# Altium project Samba2_Lantern.PrjPcb
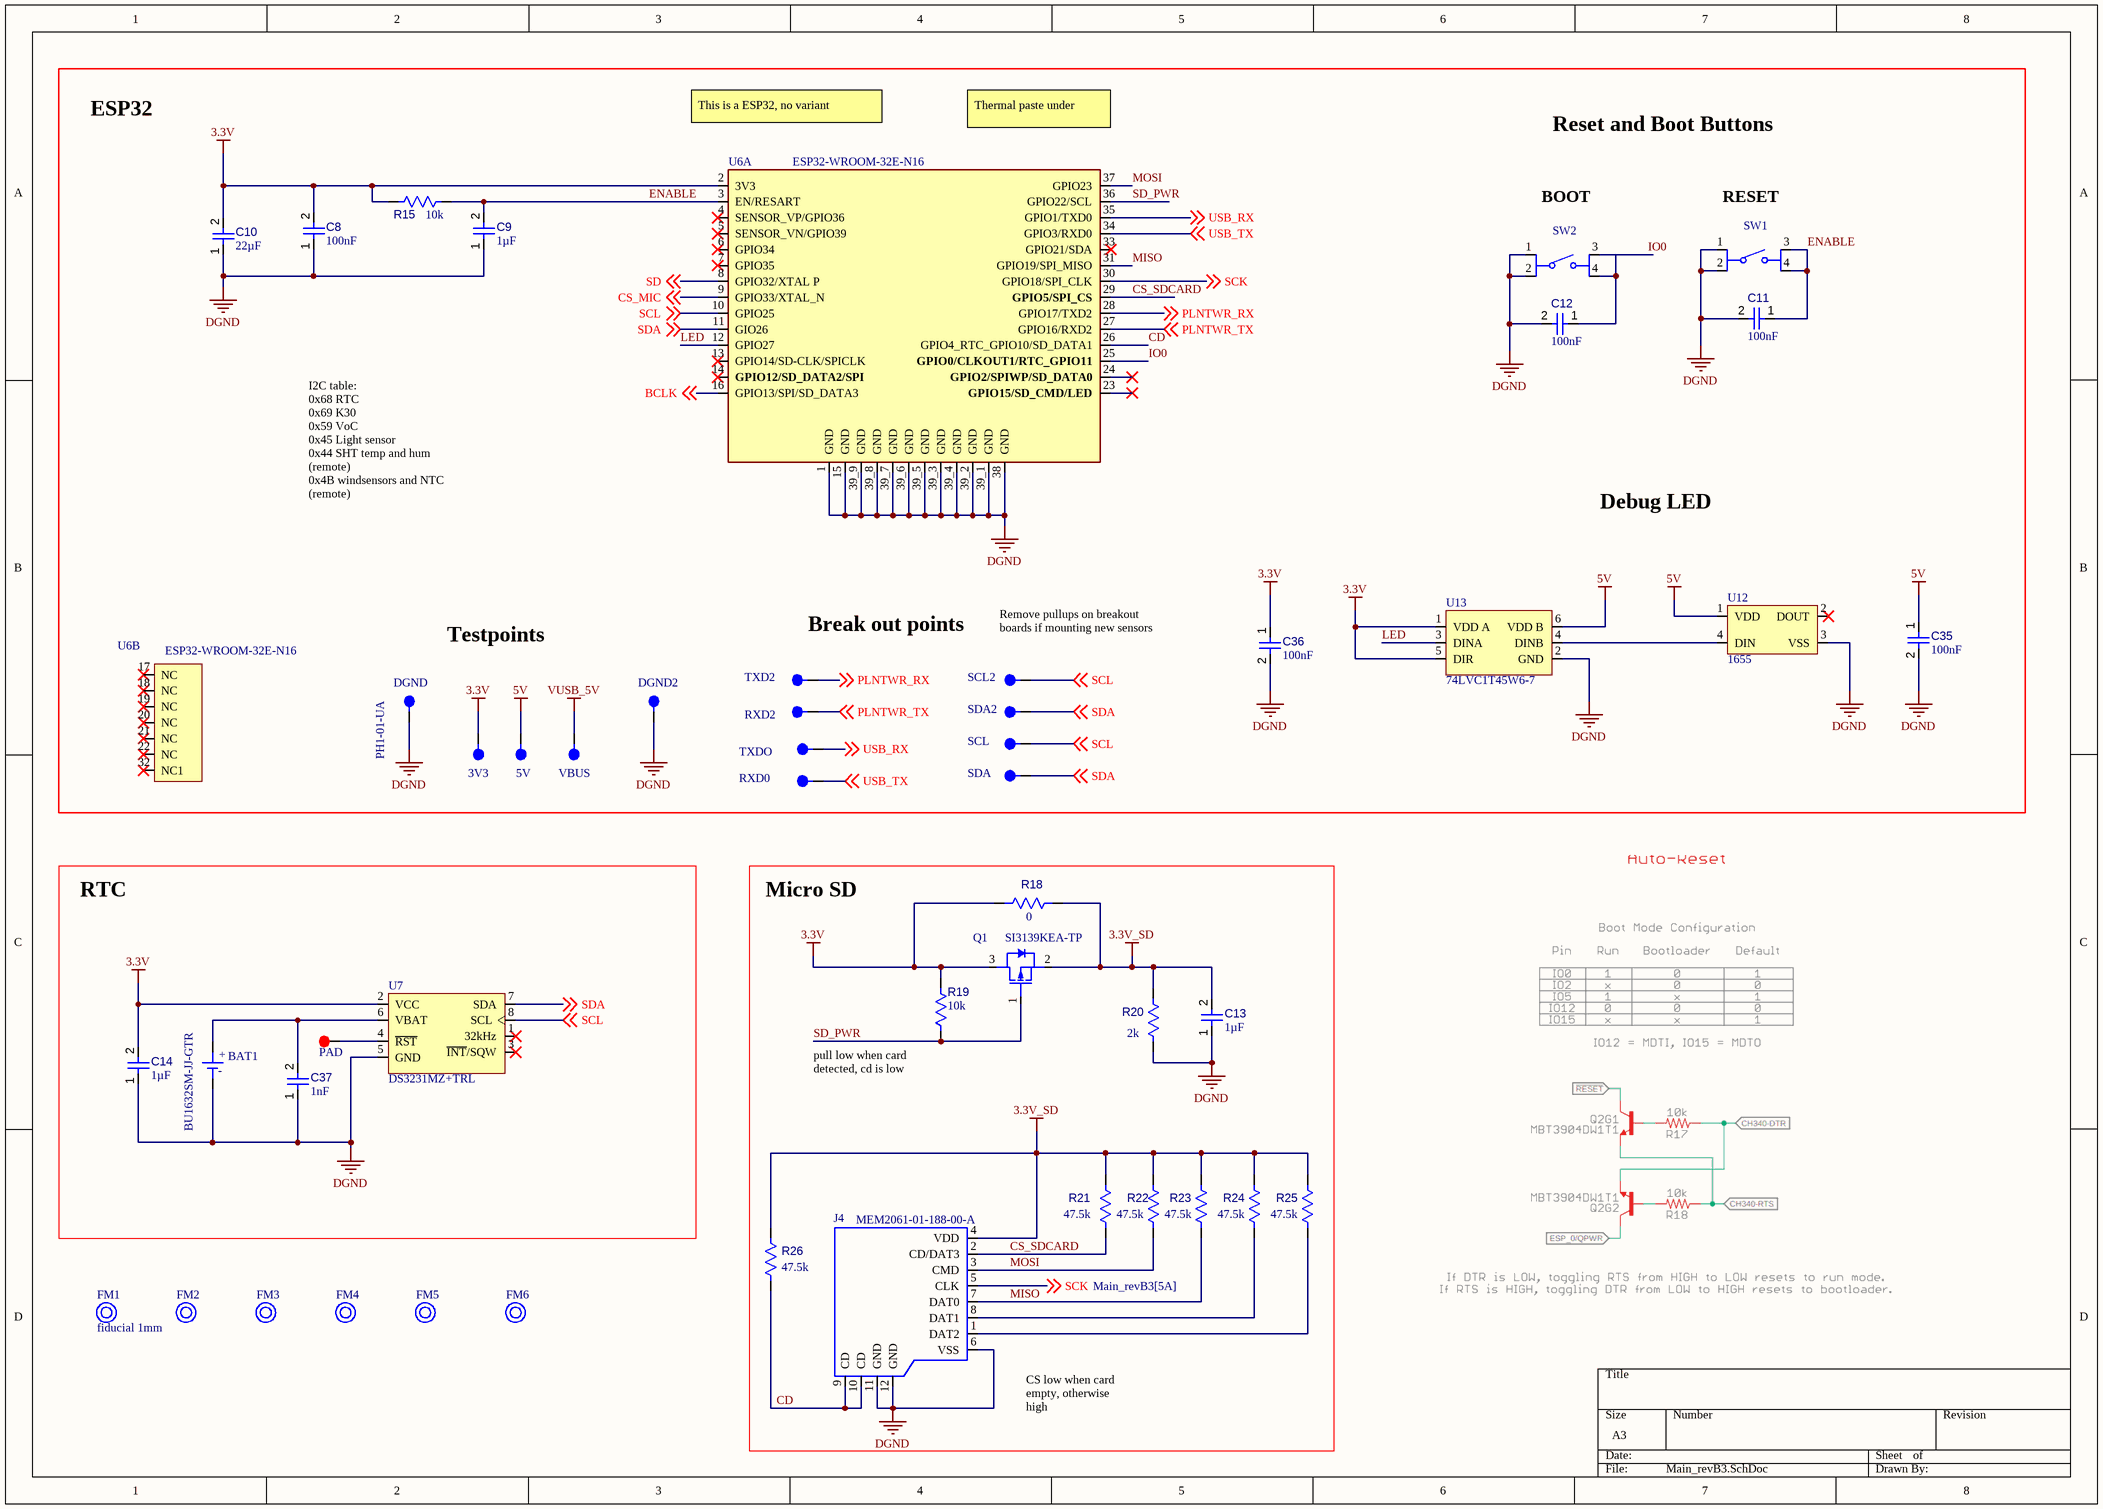
[diagram p0: Main_revB3.SchDoc]
3 sheets, 136 parts. Net scope: global (net labels, ports and power ports of the same name join across sheets).
Board file: Lantern_REV_B3.PcbDoc
Sheets:
  Main_revB3.SchDoc
  Sensors_revB3.SchDoc
  Power_revB3.SchDoc

## Sheet Main_revB3.SchDoc
size A3; SheetNumber: 1; SheetTotal: 4

### Parts
3V3  PH1-01-UA  [FP-PH1-01-UA-MFG]  (value not drawn)  (no BOM)
5V  PH1-01-UA  [FP-PH1-01-UA-MFG]  (value not drawn)  (no BOM)
BAT1  BU1632SM-JJ-GTR  [BU1632SM-JJ-GTR-Footprint-1]
C8  value 100nF  [MANUF_CAP_0603]  (hidden comment: CC0603KRX7R7BB104)
C9  value 1µF  [MANUF_CAP_0603]  (hidden comment: CL10B105KA8NFNC)
C10  value 22µF  [FP-GRM21B-0_2-e0_2_0_7-MFG]  (hidden comment: GRM21BZ71A226ME15L)
C11  value 100nF  [MANUF_CAP_0603]  (hidden comment: CC0603KRX7R7BB104)
C12  value 100nF  [MANUF_CAP_0603]  (hidden comment: CC0603KRX7R7BB104)
C13  value 1µF  [MANUF_CAP_0603]  (hidden comment: CL10B105KA8NFNC)
C14  value 1µF  [MANUF_CAP_0603]  (hidden comment: CL10B105KA8NFNC)
C35  value 100nF  [MANUF_CAP_0603]  (hidden comment: CC0603KRX7R7BB104)
C36  value 100nF  [MANUF_CAP_0603]  (hidden comment: CC0603KRX7R7BB104)
C37  value 1nF  [0805]  (hidden comment: C0805C102K2GEC7800)
DGND  PH1-01-UA  [FP-PH1-01-UA-MFG]  (no BOM)
DGND2  PH1-01-UA  [FP-PH1-01-UA-MFG]  (value not drawn)  (no BOM)
FM1  fiducial 1mm  [fiducial 1mm-Footprint-1]  (no BOM)
FM2  fiducial 1mm  [fiducial 1mm-Footprint-1]  (value not drawn)  (no BOM)
FM3  fiducial 1mm  [fiducial 1mm-Footprint-1]  (value not drawn)  (no BOM)
FM4  fiducial 1mm  [fiducial 1mm-Footprint-1]  (value not drawn)  (no BOM)
FM5  fiducial 1mm  [fiducial 1mm-Footprint-1]  (value not drawn)  (no BOM)
FM6  fiducial 1mm  [fiducial 1mm-Footprint-1]  (value not drawn)  (no BOM)
J4  MEM2061-01-188-00-A  [MEM2061-01-188-00-A-Footprint-1]
P1  PAD  [PAD-Footprint-1]  (no BOM)
Q1  SI3139KEA-TP  [SOT50P160X80-3N]
R15  value 10k  [MANUF_RES_0603]  (hidden comment: RC0603FR-0710KL)
R18  value 0  [MANUF_RES_0603]  (hidden comment: Resistor 0R +/- 5% 0603 100 mW)
R19  value 10k  [MANUF_RES_0603]  (hidden comment: RC0603FR-0710KL)
R20  value 2k  [MANUF_RES_0603]  (hidden comment: ERJ-3EKF2001V)
R21  value 47.5k  [MANUF_RES_0603]  (hidden comment: CRCW060347K5FKEAHP)
R22  value 47.5k  [MANUF_RES_0603]  (hidden comment: CRCW060347K5FKEAHP)
R23  value 47.5k  [MANUF_RES_0603]  (hidden comment: CRCW060347K5FKEAHP)
R24  value 47.5k  [MANUF_RES_0603]  (hidden comment: CRCW060347K5FKEAHP)
R25  value 47.5k  [MANUF_RES_0603]  (hidden comment: CRCW060347K5FKEAHP)
R26  value 47.5k  [MANUF_RES_0603]  (hidden comment: CRCW060347K5FKEAHP)
RXD0  PH1-01-UA  [FP-PH1-01-UA-MFG]  (value not drawn)  (no BOM)
RXD2  PH1-01-UA  [FP-PH1-01-UA-MFG]  (value not drawn)  (no BOM)
SCL  PH1-01-UA  [FP-PH1-01-UA-MFG]  (value not drawn)  (no BOM)
SCL2  PH1-01-UA  [FP-PH1-01-UA-MFG]  (value not drawn)  (no BOM)
SDA  PH1-01-UA  [FP-PH1-01-UA-MFG]  (value not drawn)  (no BOM)
SDA2  PH1-01-UA  [FP-PH1-01-UA-MFG]  (value not drawn)  (no BOM)
SW1  PTS526SK15SMTR2LFS  [FP-PTS526SK15SMTR2LFS-MFG]  (value not drawn)
SW2  PTS526SK15SMTR2LFS  [FP-PTS526SK15SMTR2LFS-MFG]  (value not drawn)
TXD2  PH1-01-UA  [FP-PH1-01-UA-MFG]  (value not drawn)  (no BOM)
TXDO  PH1-01-UA  [FP-PH1-01-UA-MFG]  (value not drawn)  (no BOM)
U6  ESP32-WROOM-32E-N16  [ESP32-WROOM-32E-N16-Footprint-1]  (parts A,B of 2)
U7  DS3231MZ+TRL  [S8MK+1_M]
U12  1655  [ADA-RGB-1655_V]
U13  74LVC1T45W6-7  [SOT95P285X130-6N]
VBUS  PH1-01-UA  [FP-PH1-01-UA-MFG]  (value not drawn)  (no BOM)

### Blocks framed on the sheet
RTC: BAT1 C14 C37 P1 U7
Micro SD: C13 J4 Q1 R18-R26

### Nets
3.3V: 3V3.1 C8.2 C10.2 C14.2 C36.1 Q1.3(D) R15.2 R18.2 R19.1 U6.2(3V3) U7.2(VCC) U13.1(VDD_A) U13.5(DIR)
3.3V_SD: C13.2 J4.4(VDD) Q1.2(S) R18.1 R20.1 R21.2 R22.2 R23.2 R24.2 R25.2 R26.2
5V: 5V.1 C35.1 U12.1(VDD) U13.6(VDD_B)
DGND: BAT1.2(-) C8.1 C9.1 C10.1 C11.2 C12.2 C13.1 C14.1 C35.2 C36.2 C37.1 DGND.1 DGND2.1 J4.6(VSS) J4.11(GND) J4.12(GND) R20.2 SW1.1 SW1.2 SW2.1 SW2.2 U6.1(GND) U6.15(GND) U6.38(GND) U6.39_1(GND) U6.39_2(GND) U6.39_3(GND) U6.39_4(GND) U6.39_5(GND) U6.39_6(GND) U6.39_7(GND) U6.39_8(GND) U6.39_9(GND) U7.5(GND) U12.3(VSS) U13.2(GND)
VUSB_5V: VBUS.1
BCLK: U6.16(GPIO13/SPI/SD_DATA3) ; off-sheet BCLK
CD: J4.9(CD) J4.10(CD) R26.1 U6.26(GPIO4_RTC_GPIO10/SD_DATA1)
CS_MIC: U6.9(GPIO33/XTAL_N) ; off-sheet CS_MIC
CS_SDCARD: J4.2(CD/DAT3) R21.1 U6.29(GPIO5/SPI_CS)
ENABLE: C9.2 C11.1 R15.1 SW1.3 SW1.4 U6.3(EN/RESART)
IO0: C12.1 SW2.3 SW2.4 U6.25(GPIO0/CLKOUT1/RTC_GPIO11)
LED: U6.12(GPIO27) U13.3(DINA)
MISO: J4.7(DAT0) R23.1 U6.31(GPIO19/SPI_MISO)
MOSI: J4.3(CMD) R22.1 U6.37(GPIO23)
PLNTWR_RX: TXD2.1 U6.28(GPIO17/TXD2) ; off-sheet PLNTWR_RX
PLNTWR_TX: RXD2.1 U6.27(GPIO16/RXD2) ; off-sheet PLNTWR_TX
SCK: J4.5(CLK) U6.30(GPIO18/SPI_CLK) ; off-sheet SCK
SCL: SCL.1 SCL2.1 U6.10(GPIO25) U7.8(SCL) ; off-sheet SCL
SD: U6.8(GPIO32/XTAL_P) ; off-sheet SD
SD_PWR: Q1.1(G) R19.2 U6.36(GPIO22/SCL)
SDA: SDA.1 SDA2.1 U6.11(GIO26) U7.7(SDA) ; off-sheet SDA
USB_RX: TXDO.1 U6.35(GPIO1/TXD0) ; off-sheet USB_RX
USB_TX: RXD0.1 U6.34(GPIO3/RXD0) ; off-sheet USB_TX
NetBAT1_1: BAT1.1(+) C37.2 U7.6(VBAT)
NetJ4_1: J4.1(DAT2) R25.1
NetJ4_8: J4.8(DAT1) R24.1
NetP1_1: P1.1 U7.4(~{RST})
NetU12_4: U12.4(DIN) U13.4(DINB)

Not connected (* = marked no-connect by the designer): U6 4(SENSOR_VP/GPIO36)* 5(SENSOR_VN/GPIO39)* 6(GPIO34)* 7(GPIO35)* 13(GPIO14/SD-CLK/SPICLK)* 14(GPIO12/SD_DATA2/SPI)* 17(NC)* 18(NC)* 19(NC)* 20(NC)* 21(NC)* 22(NC)* 23(GPIO15/SD_CMD/LED)* 24(GPIO2/SPIWP/SD_DATA0)* 32(NC1)* 33(GPIO21/SDA)*; U7 1(32kHz)* 3(~{INT}/SQW)*; U12 2(DOUT)*

### Notes on the sheet
- ESP32
- This is a ESP32, no variant
- Thermal paste under
- Reset and Boot Buttons
- (near SW2) BOOT
- (near SW1) RESET
- Debug LED
- I2C table:
  0x68 RTC
  0x69 K30
  0x59 VoC
  0x45 Light sensor
  0x44 SHT temp and hum (remote)
  0x4B windsensors and NTC (remote)
- Testpoints
- Break out points
- (near SCL2) Remove pullups on breakout boards if mounting new sensors
- (near R19) pull low when card detected, cd is low
- CS low when card empty, otherwise high

### Library data of the parts
3V3 5V DGND DGND2 RXD0 RXD2 SCL SCL2 SDA SDA2 TXD2 TXDO VBUS = CMP-002-00083-1: Conn Unshrouded Header HDR 1 POS 2.54mm Solder ST Thru-Hole Bag
BAT1 = CMP-002-00085-2: battery holder cr1632
C8 C11 C12 C35 C36 = CMP-001-00099-4: Ceramic Capacitor, Multilayer, Ceramic, 16V, 10% +Tol, 10% -Tol, X7R, 15% TC, 0.1uF, Surface Mount, 0603; Pins: 2; Min Operating Temperature: -55°C; Max Operating Temperature: 125°C; Case/Package: 0603; RoHS Compliant: Yes; Mounting Technology: Surface Mount; Capacitor Type: Ceramic
C9 C13 C14 = CMP-001-00098-2: Ceramic Capacitor, Multilayer, Ceramic, 25V, 10% +Tol, 10% -Tol, X7R, 15% TC, 1uF, Surface Mount, 0603; Pins: 2; Mounting Technology: Surface Mount; Min Operating Temperature: -55°C; Case/Package: 0603; Capacitor Type: Ceramic; RoHS Compliant: Yes; Max Operating Temperature: 125°C
C10 = CMP-001-00091-2: Ceramic Capacitor, Multilayer, Ceramic, 10V, 20% +Tol, 20% -Tol, X7R, 15% TC, 22uF, Surface Mount, 0805; Capacitor Type: Ceramic; Min Operating Temperature: -55°C; Pins: 2; Max Operating Temperature: 125°C; Case/Package: 0805; Mounting Technology: Surface Mount; RoHS Compliant: Yes
C37 = CMP-001-00100-1: ESD SMD Comm C0G 0805 (2012Metric) Ceramic Capacitor 0.079Lx0.049W 2.00mmx1.25mm C0G NP0 ±10% 1000pF; Tolerance: 10%; Case/Package: 0805
FM1-FM6 = CMP-00030-00004-9: fiducial marker 2D
J4 = CMP-002-00080-1: Micro SD card, push in, push out; Connector Type: PCB; RoHS Compliant: Yes
P1 = CMP-00030-00002-1: a pad to pull out pins
Q1 = CMP-013-00037-1: P-Channel 20 V 600 mA 150 mW Surface Mount Mosfet - SOT-523
R15 R19 = CMP-009-00204-2: Fixed Resistor, Metal Glaze/thick Film, 0.1W, 10000ohm, 75V, 1% +/-Tol, 100ppm/Cel, Surface Mount, 0603; Power: 100mW; Pins: 2; Max Operating Temperature: 155°C; Case/Package: 0603; RoHS Compliant: Yes; Tolerance: 1%; Min Operating Temperature: -55°C; Mounting Technology: Surface Mount
R18 = CMP-009-00006-8: Chip Resistor, 0 Ohm, 0.1 W, -55 to 155 degC, 0603 (1608 Metric); Power: 100mW; Voltage Rating: 50V; Max Operating Temperature: 155°C; RoHS Compliant: True; Mounting Technology: SM; Case/Package: 0603; Min Operating Temperature: -55°C; Tolerance: 5%; Pins: 2
R20 = CMP-009-00207-2: Fixed Resistor, Metal Glaze/thick Film, 0.1W, 2000ohm, 75V, 1% +/-Tol, 100ppm/Cel, Surface Mount, 0603; Power: 100mW; RoHS Compliant: Yes; Pins: 2; Max Operating Temperature: 155°C; Case/Package: 0603; Tolerance: 1%; Mounting Technology: Surface Mount; Min Operating Temperature: -55°C
R21-R26 = CMP-009-00197-3: Fixed Resistor, Metal Glaze/thick Film, 0.33W, 47500ohm, 75V, 1% +/-Tol, 100ppm/Cel, Surface Mount, 0603; Power: 250mW; Min Operating Temperature: -55°C; RoHS Compliant: Yes; Mounting Technology: Surface Mount; Tolerance: 1%; Case/Package: 0603; Max Operating Temperature: 155°C; Pins: 2
SW1 SW2 = CMP-011-00013-2: Switch Tactile N.O. SPST Round Button Gull Wing 0.05A 12VDC 200000Cycles 2.45N SMD T/R
U6 = CMP-020-00023-6: WiFi-Module 802.11/BT 2, 4-2, 5GHz 150Mb/s
U7 = CMP-00023-00005-1: Real Time Clock, Non-Volatile, 1 Timer(s), CMOS, PDSO8; RoHS Compliant: Yes; Max Operating Temperature: 85°C; Min Operating Temperature: -45°C; Case/Package: SOP; Pins: 8
U12 = CMP-00026-00001-3: WS2812B 5050 RGB LED WITH INTEGRATED DRIVER CHIP PACK OF 10
U13 = CMP-015-00009-1: Bus Transceiver, LVC/LCX/Z Series, 1-Func, 1-Bit, True Output, CMOS, PDSO6; Max Supply Voltage: 5.5V; Nominal Supply Voltage: 3.3V; Min Supply Voltage: 1.65V; RoHS Compliant: Yes; Case/Package: LSSOP; Min Operating Temperature: -40°C; Max Operating Temperature: 125°C; Pins: 6

## Sheet Sensors_revB3.SchDoc
size A3; SheetNumber: 2; SheetTotal: 3
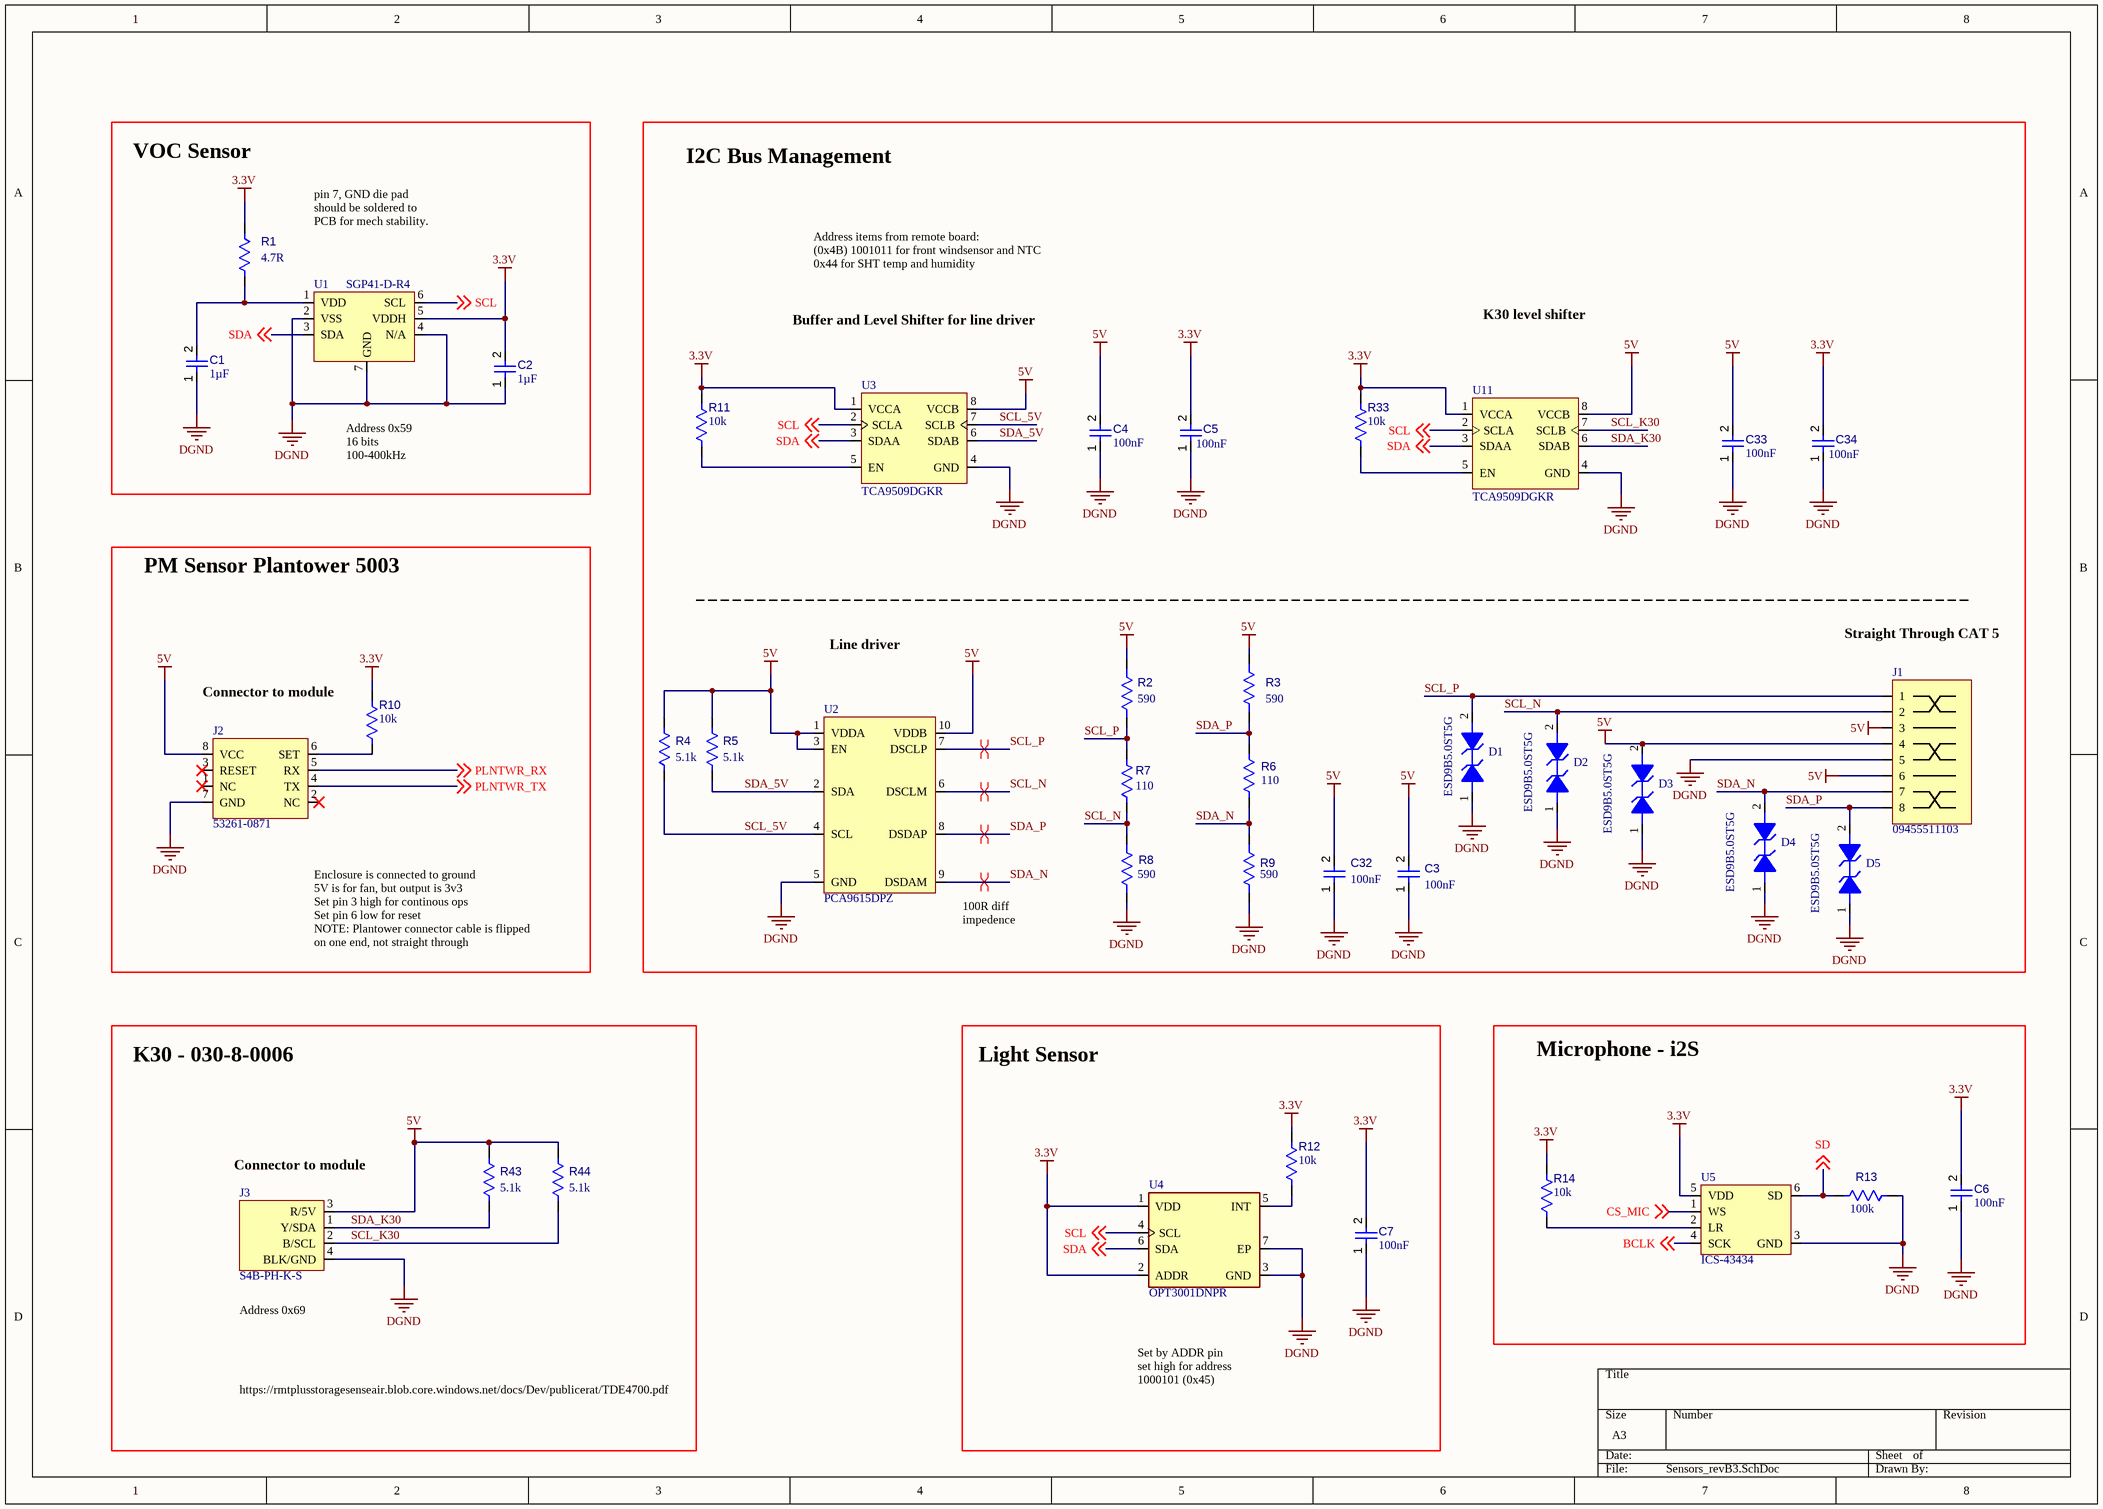
[diagram p1: Sensors_revB3.SchDoc]

### Parts
C1  value 1µF  [MANUF_CAP_0603]  (hidden comment: CL10B105KA8NFNC)
C2  value 1µF  [MANUF_CAP_0603]  (hidden comment: CL10B105KA8NFNC)
C3  value 100nF  [MANUF_CAP_0603]  (hidden comment: CC0603KRX7R7BB104)
C4  value 100nF  [MANUF_CAP_0603]  (hidden comment: CC0603KRX7R7BB104)
C5  value 100nF  [MANUF_CAP_0603]  (hidden comment: CC0603KRX7R7BB104)
C6  value 100nF  [MANUF_CAP_0603]  (hidden comment: CC0603KRX7R7BB104)
C7  value 100nF  [MANUF_CAP_0603]  (hidden comment: CC0603KRX7R7BB104)
C32  value 100nF  [MANUF_CAP_0603]  (hidden comment: CC0603KRX7R7BB104)
C33  value 100nF  [MANUF_CAP_0603]  (hidden comment: CC0603KRX7R7BB104)
C34  value 100nF  [MANUF_CAP_0603]  (hidden comment: CC0603KRX7R7BB104)
D1  ESD9B5.0ST5G  [ONSC-SOD-923-2-514AB-01_V]
D2  ESD9B5.0ST5G  [ONSC-SOD-923-2-514AB-01_V]
D3  ESD9B5.0ST5G  [ONSC-SOD-923-2-514AB-01_V]
D4  ESD9B5.0ST5G  [ONSC-SOD-923-2-514AB-01_V]
D5  ESD9B5.0ST5G  [ONSC-SOD-923-2-514AB-01_V]
J1  09455511103  [09455511103-Footprint-1]
J2  53261-0871  [FP-532610871-MFG]
J3  S4B-PH-K-S  [S4B-PH-K-S-Footprint-1]
R1  value 4.7R  [0805]  (hidden comment: SR0805FR-7W4R7L)
R2  value 590  [MANUF_RES_0603]  (hidden comment: ERJ-3EKF5900V)
R3  value 590  [MANUF_RES_0603]  (hidden comment: ERJ-3EKF5900V)
R4  value 5.1k  [0805]  (hidden comment: RC0805JR-075K1L)
R5  value 5.1k  [0805]  (hidden comment: RC0805JR-075K1L)
R6  value 110  [MANUF_RES_0603]  (hidden comment: RMCF0603FT110R)
R7  value 110  [MANUF_RES_0603]  (hidden comment: RMCF0603FT110R)
R8  value 590  [MANUF_RES_0603]  (hidden comment: ERJ-3EKF5900V)
R9  value 590  [MANUF_RES_0603]  (hidden comment: ERJ-3EKF5900V)
R10  value 10k  [MANUF_RES_0603]  (hidden comment: RC0603FR-0710KL)
R11  value 10k  [MANUF_RES_0603]  (hidden comment: RC0603FR-0710KL)
R12  value 10k  [MANUF_RES_0603]  (hidden comment: RC0603FR-0710KL)
R13  value 100k  [FP-RNCP0805-MFG]  (hidden comment: RCC0805100KFKEA)
R14  value 10k  [MANUF_RES_0603]  (hidden comment: RC0603FR-0710KL)
R33  value 10k  [MANUF_RES_0603]  (hidden comment: RC0603FR-0710KL)
R43  value 5.1k  [0805]  (hidden comment: RC0805JR-075K1L)
R44  value 5.1k  [0805]  (hidden comment: RC0805JR-075K1L)
U1  SGP41-D-R4  [SGP41-D-R4-Footprint-1]
U2  PCA9615DPZ  [TSSOP50P490X110-10N]
U3  TCA9509DGKR  [TSOP65P490X110-8N]
U4  OPT3001DNPR  [FP-DNP0006A-MFG]
U5  ICS-43434  [FP-ICS-43434-MFG]
U11  TCA9509DGKR  [TSOP65P490X110-8N]

### Blocks framed on the sheet
VOC Sensor: C1 C2 R1 U1
I2C Bus Management: C3-C5 C32-C34 D1-D5 J1 R2-R9 R11 R33 U2 U3 U11
PM Sensor Plantower 5003: J2 R10
K30 - 030-8-0006: J3 R43 R44
Light Sensor: C7 R12 U4
Microphone - i2S: C6 R13 R14 U5

### Nets
3.3V: C2.2 C5.2 C6.2 C7.2 C34.2 R1.2 R10.1 R11.1 R12.1 R14.1 R33.1 U1.5(VDDH) U3.1(VCCA) U4.1(VDD) U4.2(ADDR) U5.5(VDD) U11.1(VCCA)
5V: C3.2 C4.2 C32.2 C33.2 D3.2(A2) J1.3 J1.4 J1.6 J2.8(VCC) J3.3(R/5V) R2.2 R3.2 R4.2 R5.2 R43.2 R44.2 U2.1(VDDA) U2.3(EN) U2.10(VDDB) U3.8(VCCB) U11.8(VCCB)
DGND: C1.1 C2.1 C3.1 C4.1 C5.1 C6.1 C7.1 C32.1 C33.1 C34.1 D1.1(A1) D2.1(A1) D3.1(A1) D4.1(A1) D5.1(A1) J1.5 J2.7(GND) J3.4(BLK/GND) R8.1 R9.1 R13.1 U1.2(VSS) U1.4(N/A) U1.7(GND) U2.5(GND) U3.4(GND) U4.3(GND) U4.7(EP) U5.3(GND) U11.4(GND)
BCLK: U5.4(SCK) ; off-sheet BCLK
CS_MIC: U5.1(WS) ; off-sheet CS_MIC
PLNTWR_RX: J2.5(RX) ; off-sheet PLNTWR_RX
PLNTWR_TX: J2.4(TX) ; off-sheet PLNTWR_TX
SCL: U1.6(SCL) U3.2(SCLA) U4.4(SCL) U11.2(SCLA) ; off-sheet SCL
SCL_5V: R4.1 U2.4(SCL) U3.7(SCLB)
SCL_K30: J3.2(B/SCL) R44.1 U11.7(SCLB)
SCL_N: D2.2(A2) J1.2 R7.1 R8.2 U2.6(DSCLM)
SCL_P: D1.2(A2) J1.1 R2.1 R7.2 U2.7(DSCLP)
SD: R13.2 U5.6(SD) ; off-sheet SD
SDA: U1.3(SDA) U3.3(SDAA) U4.6(SDA) U11.3(SDAA) ; off-sheet SDA
SDA_5V: R5.1 U2.2(SDA) U3.6(SDAB)
SDA_K30: J3.1(Y/SDA) R43.1 U11.6(SDAB)
SDA_N: D4.2(A2) J1.7 R6.1 R9.2 U2.9(DSDAM)
SDA_P: D5.2(A2) J1.8 R3.1 R6.2 U2.8(DSDAP)
NetC1_2: C1.2 R1.1 U1.1(VDD)
NetJ2_6: J2.6(SET) R10.2
NetR11_2: R11.2 U3.5(EN)
NetR12_2: R12.2 U4.5(INT)
NetR14_2: R14.2 U5.2(LR)
NetR33_2: R33.2 U11.5(EN)

Not connected (* = marked no-connect by the designer): J2 1(NC)* 2(NC)* 3(RESET)*

### Layout directives
differential pair: SCL_N, SCL_P, SDA_N, SDA_P

### Notes on the sheet
- pin 7, GND die pad should be soldered to PCB for mech stability.
- Address items from remote board:
  (0x4B) 1001011 for front windsensor and NTC
  0x44 for SHT temp and humidity
- Buffer and Level Shifter for line driver
- K30 level shifter
- Address 0x59
  16 bits
  100-400kHz
- Line driver
- (near J1) Straight Through CAT 5
- (near R10) Connector to module
- Enclosure is connected to ground
  5V is for fan, but output is 3v3
  Set pin 3 high for continous ops
  Set pin 6 low for reset
  NOTE: Plantower connector cable is flipped on one end, not straight through
- (near U2) 100R diff impedence
- (near J3) Connector to module
- (near J3) Address 0x69
- Set by ADDR pin
  set high for address 1000101 (0x45)
- https://rmtplusstoragesenseair.blob.core.windows.net/docs/Dev/publicerat/TDE4700.pdf

### Library data of the parts
C1 C2 = CMP-001-00098-2: as C9 on sheet Main_revB3; Pins: 2; Mounting Technology: Surface Mount; Min Operating Temperature: -55°C; Case/Package: 0603; Capacitor Type: Ceramic; RoHS Compliant: Yes; Max Operating Temperature: 125°C
C3-C7 C32-C34 = CMP-001-00099-4: as C8 on sheet Main_revB3; Pins: 2; Min Operating Temperature: -55°C; Max Operating Temperature: 125°C; Case/Package: 0603; RoHS Compliant: Yes; Mounting Technology: Surface Mount; Capacitor Type: Ceramic
D1-D5 = CMP-004-00032-1: Trans Voltage Suppressor Diode, 5V V(RWM), Bidirectional, 1 Element, Silicon; Pins: 2; Max Operating Temperature: 150°C; RoHS Compliant: Yes; Min Operating Temperature: -55°C
J1 = CMP-002-00071-6: Telecom and Datacom Connector, 8 Contact(s), Female, Straight, Solder Terminal, Locking, Jack; Mounting Technology: Board; RoHS Compliant: Yes; Max Operating Temperature: 70°C; Min Operating Temperature: -40°C; Connector Type: TELECOM AND DATACOM CONNECTOR
J2 = CMP-010-00028-3: PLANTOWER 5003 CONNECTOR - Board Connector, 8 Contact(s), 1 Row(s), Male, Right Angle, 0.049 inch Pitch, Surface Mount Terminal, Locking, Natural Insulator, Receptacle; RoHS Compliant: Yes; Max Operating Temperature: 85°C; Min Operating Temperature: -40°C; Mounting Technology: Board
J3 = CMP-002-00076-3: K30 cable connector
R1 = CMP-009-00185-2: Fixed Resistor, Metal Glaze/thick Film, 0.25W, 4.7ohm, 150V, 1% +/-Tol, 200ppm/Cel, Surface Mount, 0805; Power: 250mW; Case/Package: 0805; Mounting Technology: Surface Mount; RoHS Compliant: Yes; Pins: 2; Max Operating Temperature: 155°C; Min Operating Temperature: -55°C; Tolerance: 1%
R2 R3 R8 R9 = CMP-009-00193-4: Fixed Resistor, Metal Glaze/thick Film, 0.1W, 590ohm, 75V, 1% +/-Tol, 100ppm/Cel, Surface Mount, 0603; Power: 100mW; Tolerance: 1%; Pins: 2; Mounting Technology: Surface Mount; Max Operating Temperature: 155°C; Min Operating Temperature: -55°C; RoHS Compliant: Yes; Case/Package: 0603
R4 R5 R43 R44 = CMP-009-00191-2: Fixed Resistor, Metal Glaze/thick Film, 0.125W, 5100ohm, 150V, 5% +/-Tol, 100ppm/Cel, Surface Mount, 0805; Power: 125mW; Min Operating Temperature: -55°C; Case/Package: 0805; Pins: 2; Max Operating Temperature: 155°C; Tolerance: 5%; Mounting Technology: Surface Mount; RoHS Compliant: Yes
R6 R7 = CMP-009-00194-4: Fixed Resistor, Metal Glaze/thick Film, 0.1W, 110ohm, 75V, 1% +/-Tol, 100ppm/Cel, Surface Mount, 0603; Power: 100mW; Tolerance: 1%; Min Operating Temperature: -55°C; Case/Package: 0603; RoHS Compliant: Yes; Pins: 2; Mounting Technology: Surface Mount; Max Operating Temperature: 155°C
R10-R12 R14 R33 = CMP-009-00204-2: as R15 on sheet Main_revB3; Pins: 2; Max Operating Temperature: 155°C; Case/Package: 0603; RoHS Compliant: Yes; Tolerance: 1%; Min Operating Temperature: -55°C; Mounting Technology: Surface Mount
R13 = CMP-009-00179-2: Fixed Resistor, Metal Glaze/thick Film, 0.25W, 100000ohm, 200V, 1% +/-Tol, 100ppm/Cel, Surface Mount, 0805; Power: 250mW; Case/Package: 0805; RoHS Compliant: Yes; Max Operating Temperature: 155°C; Tolerance: 1%; Min Operating Temperature: -55°C; Mounting Technology: Surface Mount; Pins: 2
U1 = CMP-010-00025-3: Air Quality Gas Sensor Voc/no
U2 = CMP-00024-00007-3: IC Redriver I2C 2CH 10TSSOP
U3 U11 = CMP-00024-00006-2: Interface Circuit, PDSO8; Pins: 8; Case/Package: TSSOP; Min Operating Temperature: -40°C; RoHS Compliant: Yes; Max Operating Temperature: 85°C
U4 = CMP-010-00029-2: Analog Circuit, 1 Func, 1 Channel, PDSO6; Nominal Supply Voltage: 3.3V; Max Supply Voltage: 3.6V; Min Supply Voltage: 1.6V; Pins: 6; Max Operating Temperature: 85°C; Case/Package: HVSON; Min Operating Temperature: -40°C; RoHS Compliant: Yes
U5 = CMP-010-00026-5: MICROPHONE MEMS DIGITAL I2S OMNI

## Sheet Power_revB3.SchDoc
size A3; SheetNumber: 3; SheetTotal: 3
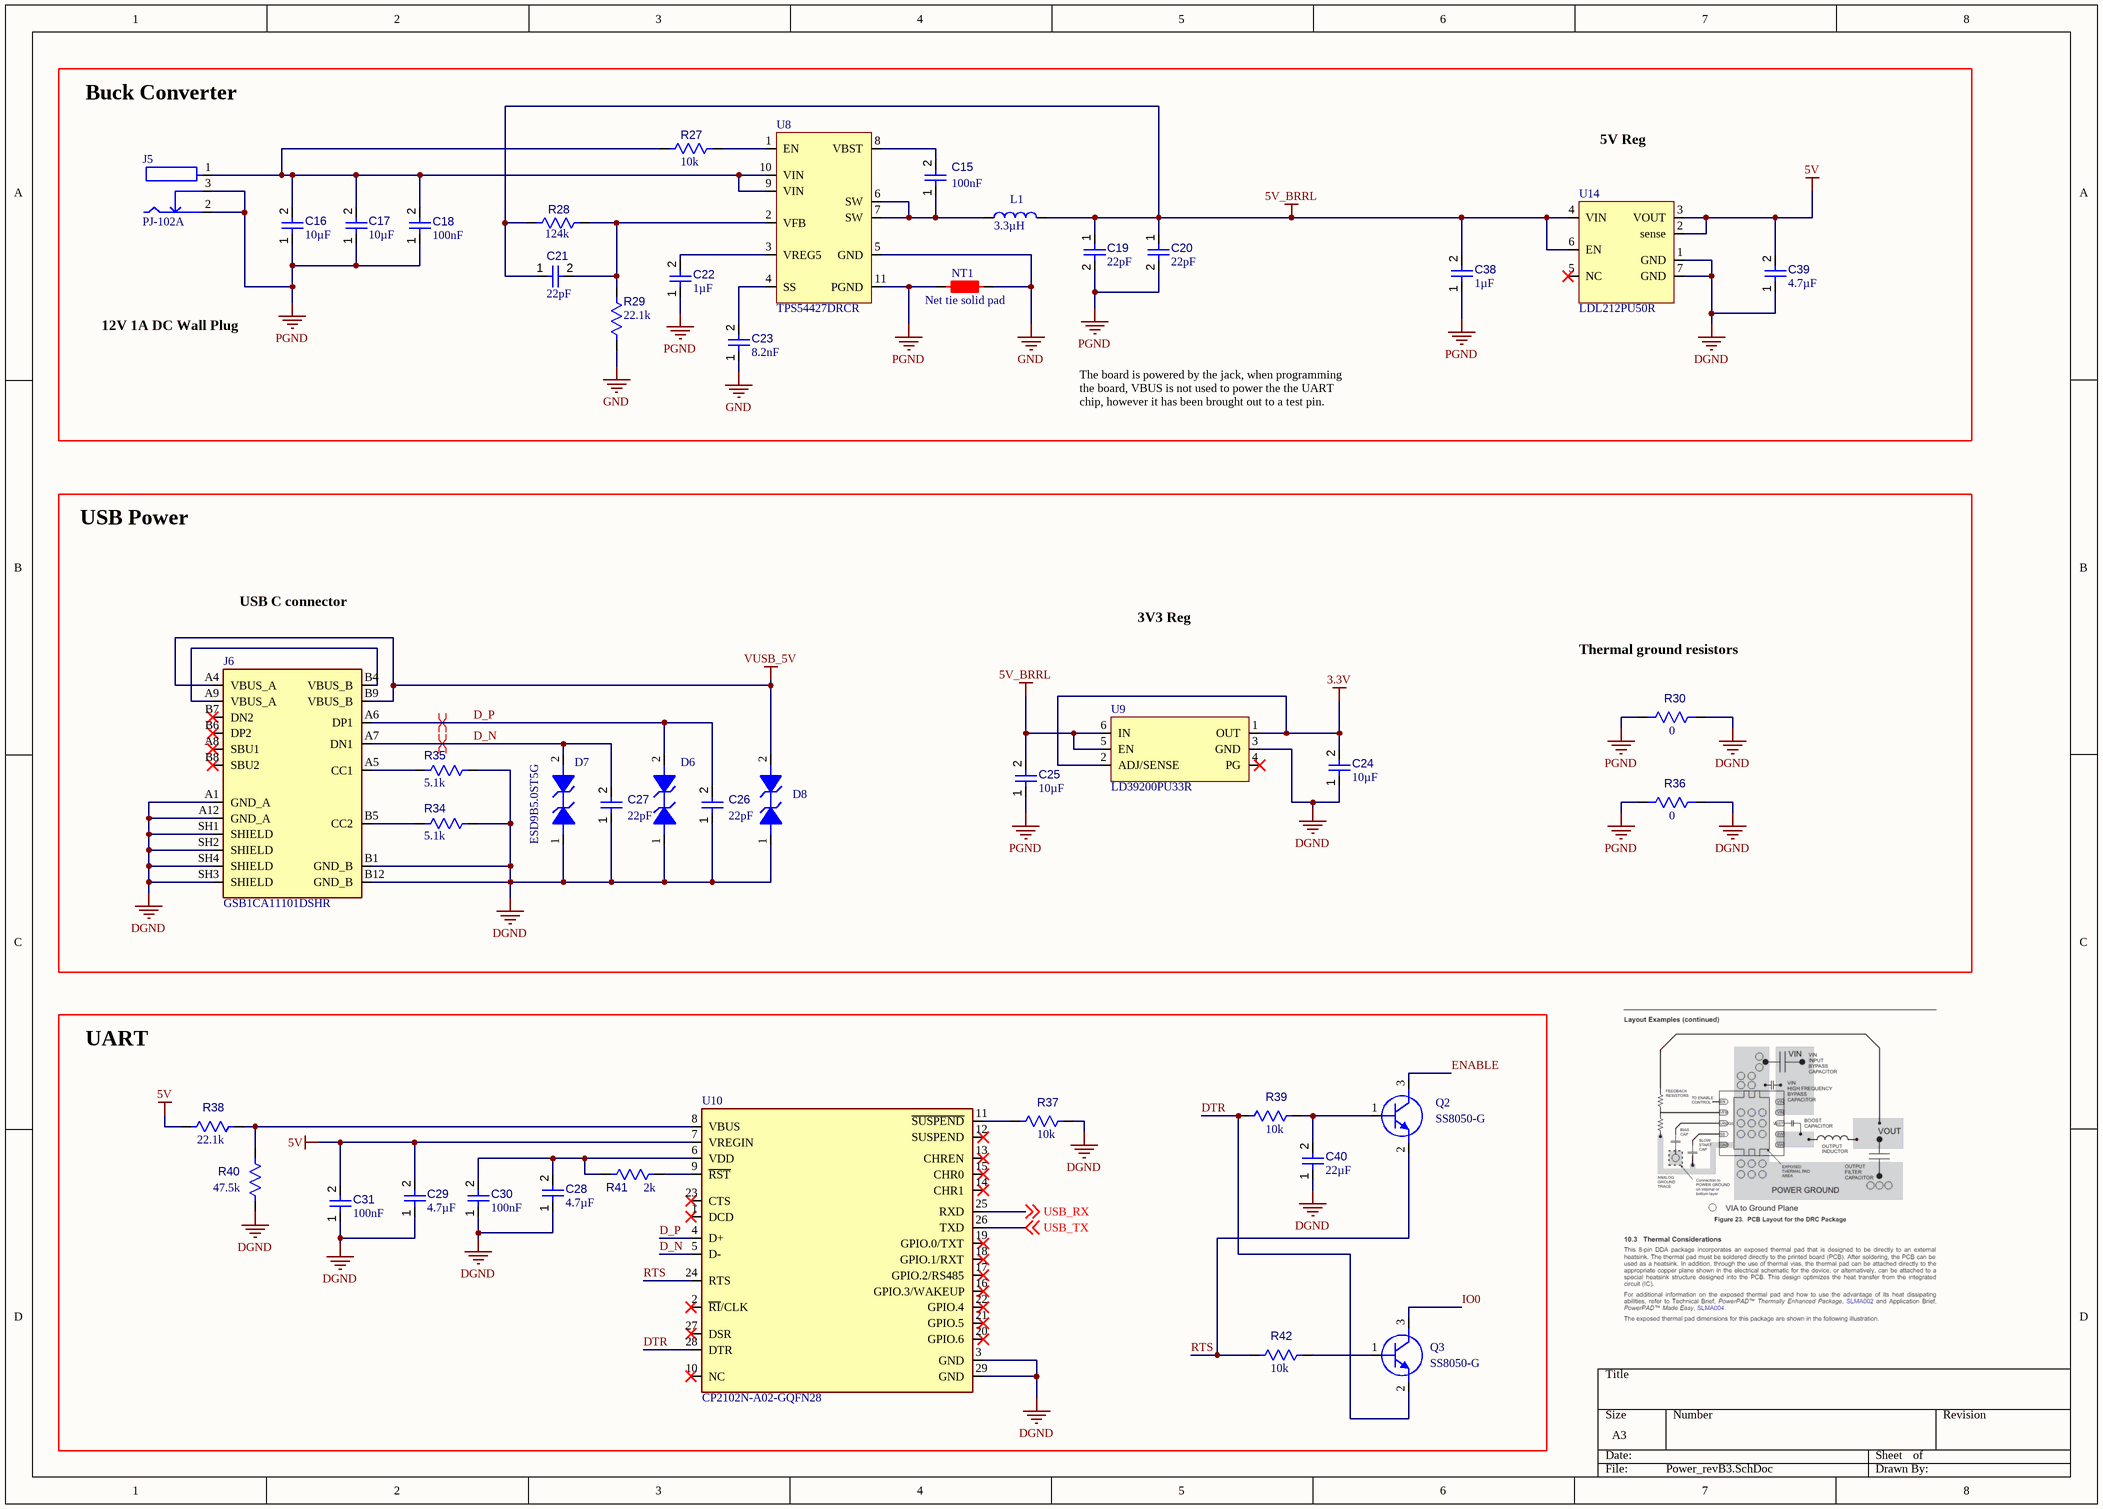
[diagram p2: Power_revB3.SchDoc]

### Parts
C15  value 100nF  [MANUF_CAP_0603]  (hidden comment: CC0603KRX7R7BB104)
C16  value 10µF  [FP-1210-L_3_2_0_3-W_2_5_0-MFG]  (hidden comment: C1210C106M3RACTU)
C17  value 10µF  [FP-1210-L_3_2_0_3-W_2_5_0-MFG]  (hidden comment: C1210C106M3RACTU)
C18  value 100nF  [MANUF_CAP_0603]  (hidden comment: CC0603KRX7R7BB104)
C19  value 22pF  [MANUF_CAP_0603]  (hidden comment: C0603C220J5GACTU)
C20  value 22pF  [MANUF_CAP_0603]  (hidden comment: C0603C220J5GACTU)
C21  value 22pF  [MANUF_CAP_0603]  (hidden comment: C0603C220J5GACTU)
C22  value 1µF  [MANUF_CAP_0603]  (hidden comment: CL10B105KA8NFNC)
C23  value 8.2nF  [FP-GRM188-0_1-e0_2_0_5-MFG]  (hidden comment: GRM1885C1H822JA01D)
C24  value 10µF  [FP-CL21B106KOQNNNE-IPC_A]  (hidden comment: CL21B106KOQNNNE)
C25  value 10µF  [FP-CL21B106KOQNNNE-IPC_A]  (hidden comment: CL21B106KOQNNNE)
C26  value 22pF  [CAPC0402(1005)60_L]  (hidden comment: Capacitor 22pF +/-10% 50V 0402)
C27  value 22pF  [CAPC0402(1005)60_L]  (hidden comment: Capacitor 22pF +/-10% 50V 0402)
C28  value 4.7µF  [MANUF_CAP_0603]  (hidden comment: Capacitor 4.7µF +/-20% 10V 0603)
C29  value 4.7µF  [MANUF_CAP_0603]  (hidden comment: Capacitor 4.7µF +/-20% 10V 0603)
C30  value 100nF  [MANUF_CAP_0603]  (hidden comment: CC0603KRX7R7BB104)
C31  value 100nF  [MANUF_CAP_0603]  (hidden comment: CC0603KRX7R7BB104)
C38  value 1µF  [MANUF_CAP_0603]  (hidden comment: CL10B105KA8NFNC)
C39  value 4.7µF  [MANUF_CAP_0603]  (hidden comment: Capacitor 4.7µF +/-20% 10V 0603)
C40  value 22µF  [FP-GRM21B-0_2-e0_2_0_7-MFG]  (hidden comment: GRM21BZ71A226ME15L)  (no BOM)
D6  ESD9B5.0ST5G  [ONSC-SOD-923-2-514AB-01_V]  (value not drawn)
D7  ESD9B5.0ST5G  [ONSC-SOD-923-2-514AB-01_V]
D8  ESD9B5.0ST5G  [ONSC-SOD-923-2-514AB-01_V]  (value not drawn)
J5  PJ-102A  [FP-PJ-102A-MFG]
J6  GSB1CA11101DSHR  [GSB1CA11101DSHR-Footprint-1]
L1  value 3.3µH  [INDC4141X31N]  (hidden comment: PA5430.332NLT)
NT1  Net tie solid pad  [Net tie solid pad-Footprint-1]  (net tie, no BOM)
Q2  SS8050-G  [FP-SS8050-G-IPC_C]
Q3  SS8050-G  [FP-SS8050-G-IPC_C]
R27  value 10k  [MANUF_RES_0603]  (hidden comment: RC0603FR-0710KL)
R28  value 124k  [RESC0603(1608)_L]  (hidden comment: RCS0603124KFKEA)
R29  value 22.1k  [FP-CRCW0603-HPe3-MFG]  (hidden comment: CRCW060322K1FKEAHP)
R30  value 0  [MANUF_RES_0603]  (hidden comment: Resistor 0R +/- 5% 0603 100 mW)
R34  value 5.1k  [0805]  (hidden comment: RC0805JR-075K1L)
R35  value 5.1k  [0805]  (hidden comment: RC0805JR-075K1L)
R36  value 0  [MANUF_RES_0603]  (hidden comment: Resistor 0R +/- 5% 0603 100 mW)
R37  value 10k  [MANUF_RES_0603]  (hidden comment: RC0603FR-0710KL)
R38  value 22.1k  [MANUF_RES_0603]  (hidden comment: RMCF0603FT22K1)
R39  value 10k  [MANUF_RES_0603]  (hidden comment: RC0603FR-0710KL)
R40  value 47.5k  [MANUF_RES_0603]  (hidden comment: CRCW060347K5FKEAHP)
R41  value 2k  [MANUF_RES_0603]  (hidden comment: ERJ-3EKF2001V)
R42  value 10k  [MANUF_RES_0603]  (hidden comment: RC0603FR-0710KL)
U8  TPS54427DRCR  [SON50P300X100_HS-11N]
U9  LD39200PU33R  [FP-DFN6-7946637-MFG]
U10  CP2102N-A02-GQFN28  [FP-CP2102N-A02-GQFN28-MFG]
U14  LDL212PU50R  [FP-DFN6-7946637-MFG]

### Blocks framed on the sheet
Buck Converter: C15-C23 C38 C39 J5 L1 NT1 R27-R29 U8 U14
USB Power: C24-C27 D6-D8 J6 R30 R34-R36 U9
UART: C28-C31 C40 Q2 Q3 R37-R42 U10

### Nets
3.3V: C24.2 U9.1(OUT) U9.2(ADJ/SENSE)
5V: C29.2 C31.2 C39.2 R38.1 U10.7(VREGIN) U14.2(sense) U14.3(VOUT)
5V_BRRL: C19.1 C20.1 C21.1 C25.2 C38.2 L1.2 R28.1 U9.5(EN) U9.6(IN) U14.4(VIN) U14.6(EN)
DGND: C24.1 C26.1 C27.1 C28.1 C29.1 C30.1 C31.1 C39.1 C40.1 D6.1(A1) D7.1(A1) D8.1(A1) J6.A1(GND_A) J6.A12(GND_A) J6.B1(GND_B) J6.B12(GND_B) J6.SH1(SHIELD) J6.SH2(SHIELD) J6.SH3(SHIELD) J6.SH4(SHIELD) R30.2 R34.1 R35.1 R36.2 R37.1 R40.1 U9.3(GND) U10.3(GND) U10.29(GND) U14.1(GND) U14.7(GND)
GND: C23.1 NT1.2 R29.1 U8.5(GND)
PGND: C16.1 C17.1 C18.1 C19.2 C20.2 C22.1 C25.1 C38.1 J5.2 J5.3 NT1.1 R30.1 R36.1 U8.11(PGND)
VUSB_5V: D8.2(A2) J6.A4(VBUS_A) J6.B9(VBUS_B)
D_N: C27.2 D7.2(A2) J6.A7(DN1) U10.5(D-)
D_P: C26.2 D6.2(A2) J6.A6(DP1) U10.4(D+)
DTR: Q3.2(E) R39.2 U10.28(DTR)
ENABLE: Q2.3(C)
IO0: Q3.3(C)
RTS: Q2.2(E) R42.2 U10.24(RTS)
USB_RX: U10.25(RXD) ; off-sheet USB_RX
USB_TX: U10.26(TXD) ; off-sheet USB_TX
NetC15_1: C15.1 L1.1 U8.6(SW) U8.7(SW)
NetC15_2: C15.2 U8.8(VBST)
NetC16_2: C16.2 C17.2 C18.2 J5.1 R27.2 U8.9(VIN) U8.10(VIN)
NetC21_2: C21.2 R28.2 R29.2 U8.2(VFB)
NetC22_2: C22.2 U8.3(VREG5)
NetC23_2: C23.2 U8.4(SS)
NetC28_2: C28.2 C30.2 R41.2 U10.6(VDD)
NetC40_2: C40.2 Q2.1(B) R39.1
NetJ6_A5: J6.A5(CC1) R35.2
NetJ6_A9: J6.A9(VBUS_A) J6.B4(VBUS_B)
NetJ6_B5: J6.B5(CC2) R34.2
NetQ3_1: Q3.1(B) R42.1
NetR27_1: R27.1 U8.1(EN)
NetR37_2: R37.2 U10.11(~{SUSPEND})
NetR38_2: R38.2 R40.2 U10.8(VBUS)
NetR41_1: R41.1 U10.9(~{RST})

Not connected (* = marked no-connect by the designer): J6 A8(SBU1)* B6(DP2)* B7(DN2)* B8(SBU2)*; U9 4(PG)*; U10 1(DCD)* 2(~{RI}/CLK)* 10(NC)* 12(SUSPEND)* 13(CHREN)* 14(CHR1)* 15(CHR0)* 16(GPIO.3/WAKEUP)* 17(GPIO.2/RS485)* 18(GPIO.1/RXT)* 19(GPIO.0/TXT)* 20(GPIO.6)* 21(GPIO.5)* 22(GPIO.4)* 23(CTS)* 27(DSR)*; U14 5(NC)*

### Layout directives
differential pair: D_N, D_P

### Notes on the sheet
- 5V Reg
- 12V 1A DC Wall Plug
- The board is powered by the jack, when programming the board, VBUS is not used to power the the UART chip, however it has been brought out to a test pin.
- USB C connector
- 3V3 Reg
- Thermal ground resistors

### Library data of the parts
C15 C18 C30 C31 = CMP-001-00099-4: as C8 on sheet Main_revB3; Pins: 2; Min Operating Temperature: -55°C; Max Operating Temperature: 125°C; Case/Package: 0603; RoHS Compliant: Yes; Mounting Technology: Surface Mount; Capacitor Type: Ceramic
C16 C17 = CMP-001-00089-3: Ceramic Capacitor, Multilayer, Ceramic, 25V, 20% +Tol, 20% -Tol, X7R, 15% TC, 10uF, Surface Mount, 1210; Capacitor Type: Ceramic; Case/Package: 1210; Min Operating Temperature: -55°C; Max Operating Temperature: 125°C; Pins: 2; Mounting Technology: Surface Mount; RoHS Compliant: Yes
C19-C21 = CMP-001-00095-2: Ceramic Capacitor, Multilayer, Ceramic, 50V, 5% +Tol, 5% -Tol, C0G, 30ppm/Cel TC, 0.000022uF, Surface Mount, 0603; Max Operating Temperature: 125°C; Min Operating Temperature: -55°C; Mounting Technology: Surface Mount; Case/Package: 0603; Pins: 2; Capacitor Type: Ceramic; RoHS Compliant: Yes
C22 C38 = CMP-001-00098-2: as C9 on sheet Main_revB3; Pins: 2; Mounting Technology: Surface Mount; Min Operating Temperature: -55°C; Case/Package: 0603; Capacitor Type: Ceramic; RoHS Compliant: Yes; Max Operating Temperature: 125°C
C23 = CMP-001-00096-1: Ceramic Capacitor, Multilayer, Ceramic, 50V, 5% +Tol, 5% -Tol, C0G, 30ppm/Cel TC, 0.0082uF, Surface Mount, 0603; RoHS Compliant: Yes; Capacitor Type: Ceramic; Min Operating Temperature: -55°C; Mounting Technology: Surface Mount; Max Operating Temperature: 125°C; Pins: 2; Case/Package: 0603
C24 C25 = CMP-001-00101-1: Ceramic Capacitor, Multilayer, Ceramic, 16V, 10% +Tol, 10% -Tol, X7R, 15% TC, 10uF, Surface Mount, 0805; RoHS Compliant: Yes; Max Operating Temperature: 125°C; Capacitor Type: Ceramic; Pins: 2; Min Operating Temperature: -55°C; Case/Package: 0805; Mounting Technology: Surface Mount
C26 C27 = CMP-001-00073-5: Chip Capacitor, 22pF +/-10%, 50V, 0402, Thickness 0.6 mm; Tolerance: 10%; Max Operating Temperature: 85°C; Voltage Rating: 50V; Pins: 2; Case/Package: 0402; Mounting Technology: SMT; Min Operating Temperature: -55°C
C28 C29 C39 = CMP-001-00076-6: Chip Capacitor, 4.7µF +/-20%, 10V, 0603, Thickness 1 mm; Tolerance: 10%; Max Operating Temperature: 85°C; Voltage Rating: 10V; Min Operating Temperature: -55°C; Case/Package: 0603; Mounting Technology: SMT; Pins: 2
C40 = CMP-001-00091-2: as C10 on sheet Main_revB3; Capacitor Type: Ceramic; Min Operating Temperature: -55°C; Pins: 2; Max Operating Temperature: 125°C; Case/Package: 0805; Mounting Technology: Surface Mount; RoHS Compliant: Yes
D6-D8 = CMP-004-00032-1: as D1 on sheet Sensors_revB3; Pins: 2; Max Operating Temperature: 150°C; RoHS Compliant: Yes; Min Operating Temperature: -55°C
J5 = CMP-002-00073-7: 16V, 2.5A, 2mm Dia; Connector Type: Circular,Power; Mounting Technology: Board; Voltage Rating: 16V; Max Current Rating: 2.5A; RoHS Compliant: Yes
J6 = CMP-002-00086-1: USB2.0, Type C, Vertical, Height 6.40mm, Dual Row Surface Mount
L1 = CMP-006-00024-1: High Current Composite Inductor - PA5430/PA5431.XXXNLT and PM5430.XXXNLT, Up to 6.6 Apk; Tolerance: 20%; Current Rating: 6.6A
NT1 = CMP-00030-00003-5
Q2 Q3 = CMP-013-00035-2: Small Signal Bipolar Transistor, 1.5A I(C), 25V V(BR)CEO, 1-Element, NPN, Silicon; RoHS Compliant: Yes
R27 R37 R39 R42 = CMP-009-00204-2: as R15 on sheet Main_revB3; Pins: 2; Max Operating Temperature: 155°C; Case/Package: 0603; RoHS Compliant: Yes; Tolerance: 1%; Min Operating Temperature: -55°C; Mounting Technology: Surface Mount
R28 = CMP-009-00198-1: Fixed Resistor, Metal Glaze/thick Film, 0.25W, 124000ohm, 75V, 1% +/-Tol, 100ppm/Cel, Surface Mount, 0603; Tolerance: 1%
R29 = CMP-009-00199-1: Fixed Resistor, Metal Glaze/thick Film, 0.33W, 22100ohm, 75V, 1% +/-Tol, 100ppm/Cel, Surface Mount, 0603; Power: 250mW; Case/Package: 0603; RoHS Compliant: Yes; Min Operating Temperature: -55°C; Pins: 2; Mounting Technology: Surface Mount; Tolerance: 1%; Max Operating Temperature: 155°C
R30 R36 = CMP-009-00006-8: as R18 on sheet Main_revB3; Max Operating Temperature: 155°C; RoHS Compliant: True; Mounting Technology: SM; Case/Package: 0603; Min Operating Temperature: -55°C; Tolerance: 5%; Pins: 2
R34 R35 = CMP-009-00191-2: as R4 on sheet Sensors_revB3; Min Operating Temperature: -55°C; Case/Package: 0805; Pins: 2; Max Operating Temperature: 155°C; Tolerance: 5%; Mounting Technology: Surface Mount; RoHS Compliant: Yes
R38 = CMP-009-00196-2: Fixed Resistor, Metal Glaze/thick Film, 0.1W, 22100ohm, 75V, 1% +/-Tol, 100ppm/Cel, Surface Mount, 0603; Power: 100mW; Case/Package: 0603; Min Operating Temperature: -55°C; RoHS Compliant: Yes; Tolerance: 1%; Max Operating Temperature: 155°C; Pins: 2; Mounting Technology: Surface Mount
R40 = CMP-009-00197-3: as R21 on sheet Main_revB3; Min Operating Temperature: -55°C; RoHS Compliant: Yes; Mounting Technology: Surface Mount; Tolerance: 1%; Case/Package: 0603; Max Operating Temperature: 155°C; Pins: 2
R41 = CMP-009-00207-2: as R20 on sheet Main_revB3; RoHS Compliant: Yes; Pins: 2; Max Operating Temperature: 155°C; Case/Package: 0603; Tolerance: 1%; Mounting Technology: Surface Mount; Min Operating Temperature: -55°C
U8 = CMP-019-00051-7: Switching Regulator, Current-mode, 4A, 650kHz Switching Freq-Max, PDSO10; Max Supply Voltage: 18V; Max Operating Temperature: 85°C; Frequency: 650kHz; RoHS Compliant: Yes; Pins: 10; Case/Package: HVSON; Min Operating Temperature: -40°C
U9 = CMP-019-00050-2: Fixed Positive LDO Regulator, 3.3V, 0.25V Dropout; Max Supply Voltage: 6V; Case/Package: HVSON; Pins: 6; RoHS Compliant: Yes
U10 = CMP-00024-00008-3: USB Bus Controller, CMOS
U14 = CMP-019-00053-2: Fixed Positive LDO Regulator, 5V, 0.6V Dropout; RoHS Compliant: Yes

## Nets that join several sheets
3.3V: Main_revB3 (13 pins), Sensors_revB3 (17 pins), Power_revB3 (C24.2 U9.1 U9.2)
5V: Main_revB3 (5V.1 C35.1 U12.1 U13.6), Sensors_revB3 (21 pins), Power_revB3 (7 pins)
DGND: Main_revB3 (36 pins), Sensors_revB3 (30 pins), Power_revB3 (31 pins)
VUSB_5V: Main_revB3 (VBUS.1), Power_revB3 (D8.2 J6.A4 J6.B9)
BCLK: Main_revB3 (U6.16), Sensors_revB3 (U5.4)
CS_MIC: Main_revB3 (U6.9), Sensors_revB3 (U5.1)
ENABLE: Main_revB3 (6 pins), Power_revB3 (Q2.3)
IO0: Main_revB3 (C12.1 SW2.3 SW2.4 U6.25), Power_revB3 (Q3.3)
PLNTWR_RX: Main_revB3 (TXD2.1 U6.28), Sensors_revB3 (J2.5)
PLNTWR_TX: Main_revB3 (RXD2.1 U6.27), Sensors_revB3 (J2.4)
SCL: Main_revB3 (SCL.1 SCL2.1 U6.10 U7.8), Sensors_revB3 (U1.6 U3.2 U4.4 U11.2)
SD: Main_revB3 (U6.8), Sensors_revB3 (R13.2 U5.6)
SDA: Main_revB3 (SDA.1 SDA2.1 U6.11 U7.7), Sensors_revB3 (U1.3 U3.3 U4.6 U11.3)
USB_RX: Main_revB3 (TXDO.1 U6.35), Power_revB3 (U10.25)
USB_TX: Main_revB3 (RXD0.1 U6.34), Power_revB3 (U10.26)

## Assembly variants
Lantern_REV_B3 manuf: not fitted 3V3 5V C11 C12 C13 C29 C31 C40 DGND DGND2 Q1 R19 R20 RXD0 RXD2 SCL SCL2 SDA SDA2 TXD2 TXDO VBUS